# Altium schematic sheet FMC_CONNECTOR.schdoc: FMC Connector
size A3; DocumentNumber: 6; SheetNumber: 6; SheetTotal: 12
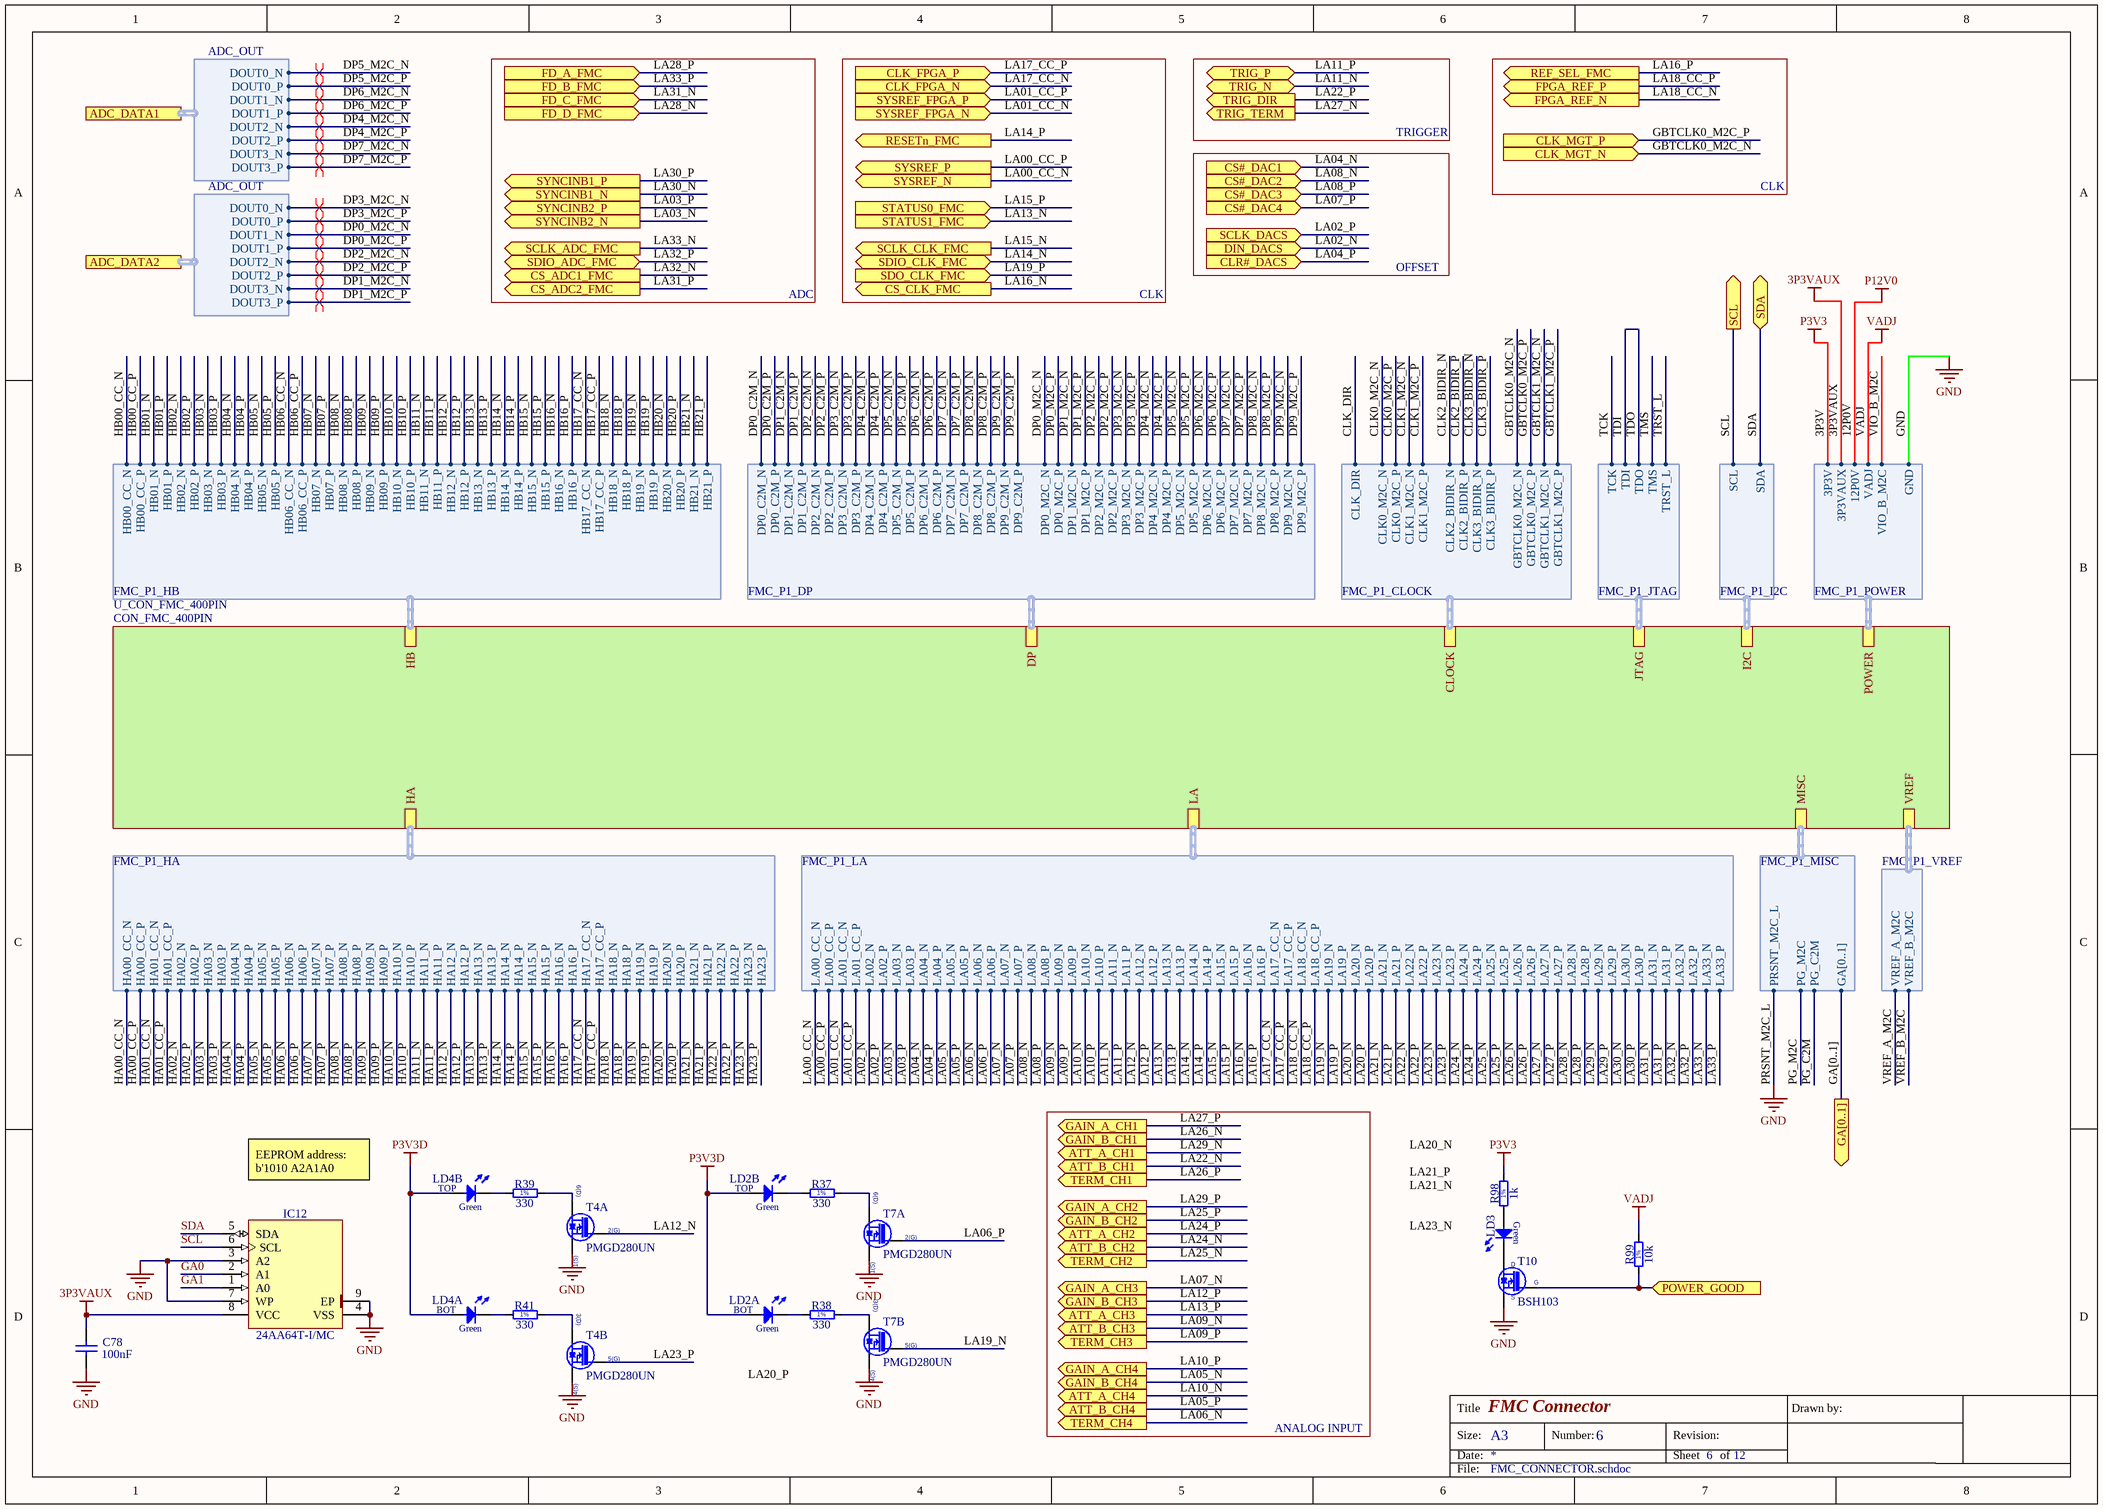
[diagram p0: FMC_CONNECTOR.schdoc]

## Parts
C78  100nF  [CAPC0603X33N]
IC12  24AA64T-I/MC  [SON50P300X200X100-9N-R175X155]
LD2  (no value)  [553-xxxx-300]  (parts A,B of 2)
LD3  (no value)  [LED0603X65N]
LD4  (no value)  [553-xxxx-300]  (parts A,B of 2)
R37  330  [RESC1005X40N]
R38  330  [RESC1005X40N]
R39  330  [RESC1005X40N]
R41  330  [RESC1005X40N]
R98  1k  [RESC1005X40N]
R99  10k  [RESC1608X55N]
T4  PMGD280UN  [SOT65P210X110-6N]  (parts A,B of 2)
T7  PMGD280UN  [SOT65P210X110-6N]  (parts A,B of 2)
T10  BSH103  [SOT95P230X110-3N]

## Sub-sheets
U_CON_FMC_400PIN = CON_FMC_400PIN: LA (harness FMC_P1_LA), HA (harness FMC_P1_HA), HB (harness FMC_P1_HB), MISC (harness FMC_P1_MISC), POWER (harness FMC_P1_POWER), JTAG (harness FMC_P1_JTAG), I2C (harness FMC_P1_I2C), CLOCK (harness FMC_P1_CLOCK), VREF (harness FMC_P1_VREF), DP (harness FMC_P1_DP)

## Ports
ADC_DATA1 (harness ADC_OUT), ADC_DATA2 (harness ADC_OUT), ATT_A_CH1 (out), ATT_A_CH2 (out), ATT_A_CH3 (out), ATT_A_CH4 (out), ATT_B_CH1 (out), ATT_B_CH2 (out), ATT_B_CH3 (out), ATT_B_CH4 (out), CLK_FPGA_N (in), CLK_FPGA_P (in), CLK_MGT_N (in), CLK_MGT_P (in), CLR#_DACS (in), CS#_DAC1 (in), CS#_DAC2 (in), CS#_DAC3 (in), CS#_DAC4 (in), CS_ADC1_FMC (out), CS_ADC2_FMC (out), CS_CLK_FMC (out), DIN_DACS (in), FD_A_FMC (in), FD_B_FMC (in), FD_C_FMC (in), FD_D_FMC (in), FPGA_REF_N (out), FPGA_REF_P (out), GA[0..1] (out), GAIN_A_CH1 (out), GAIN_A_CH2 (out), GAIN_A_CH3 (out), GAIN_A_CH4 (out), GAIN_B_CH1 (out), GAIN_B_CH2 (out), GAIN_B_CH3 (out), GAIN_B_CH4 (out), POWER_GOOD (in), REF_SEL_FMC (out), RESETn_FMC (out), SCL (out), SCLK_ADC_FMC (out), SCLK_CLK_FMC (out), SCLK_DACS (in), SDA (bidir), SDIO_ADC_FMC (bidir), SDIO_CLK_FMC (bidir), SDO_CLK_FMC (in), STATUS0_FMC (in), STATUS1_FMC (in), SYNCINB1_N (out), SYNCINB1_P (out), SYNCINB2_N (out), SYNCINB2_P (out), SYSREF_FPGA_N (in), SYSREF_FPGA_P (in), SYSREF_N (out), SYSREF_P (out), TERM_CH1 (out), TERM_CH2 (out), TERM_CH3 (out), TERM_CH4 (out), TRIG_DIR (out), TRIG_N (bidir), TRIG_P (bidir), TRIG_TERM (out)

## Harnesses
FMC_P1_DP: DP1_C2M_N, DP1_C2M_P, DP1_M2C_N, DP1_M2C_P, DP2_C2M_N, DP2_C2M_P, DP2_M2C_N, DP2_M2C_P, DP3_C2M_N, DP3_C2M_P, DP3_M2C_N, DP3_M2C_P, DP4_C2M_N, DP4_C2M_P, DP4_M2C_N, DP4_M2C_P, DP5_C2M_N, DP5_C2M_P, DP5_M2C_N, DP5_M2C_P, DP6_C2M_N, DP6_C2M_P, DP6_M2C_N, DP6_M2C_P, DP7_C2M_N, DP7_C2M_P, DP7_M2C_N, DP7_M2C_P, DP8_C2M_N, DP8_C2M_P, DP8_M2C_N, DP8_M2C_P, DP9_C2M_N, DP9_C2M_P, DP9_M2C_N, DP9_M2C_P, DP0_C2M_N, DP0_C2M_P, DP0_M2C_N, DP0_M2C_P
FMC_P1_MISC: PRSNT_M2C_L, PG_M2C, PG_C2M, GA[0..1]
FMC_P1_POWER: 3P3V, 3P3VAUX, 12P0V, VADJ, VIO_B_M2C, GND
FMC_P1_JTAG: TCK, TDI, TDO, TMS, TRST_L
FMC_P1_I2C: SCL, SDA
FMC_P1_CLOCK: CLK2_BIDIR_N, CLK2_BIDIR_P, CLK3_BIDIR_N, CLK3_BIDIR_P, CLK0_M2C_N, CLK0_M2C_P, CLK1_M2C_N, CLK1_M2C_P, CLK_DIR, GBTCLK0_M2C_N, GBTCLK0_M2C_P, GBTCLK1_M2C_N, GBTCLK1_M2C_P
FMC_P1_VREF: VREF_A_M2C, VREF_B_M2C
FMC_P1_HA: HA04_N, HA04_P, HA05_N, HA05_P, HA08_N, HA08_P, HA09_N, HA09_P, HA12_N, HA12_P, HA13_N, HA13_P, HA15_N, HA15_P, HA16_N, HA16_P, HA19_N, HA19_P, HA20_N, HA20_P, HA02_N, HA02_P, HA03_N, HA03_P, HA06_N, HA06_P, HA07_N, HA07_P, HA10_N, HA10_P, HA11_N, HA11_P, HA14_N, HA14_P, HA18_N, HA18_P, HA21_N, HA21_P, HA22_N, HA22_P, HA23_N, HA23_P, HA17_CC_N, HA17_CC_P, HA00_CC_N, HA00_CC_P, HA01_CC_N, HA01_CC_P
FMC_P1_LA: LA05_N, LA05_P, LA06_N, LA06_P, LA09_N, LA09_P, LA10_N, LA10_P, LA13_N, LA13_P, LA14_N, LA14_P, LA23_N, LA23_P, LA26_N, LA26_P, LA27_N, LA27_P, LA02_N, LA02_P, LA03_N, LA03_P, LA04_N, LA04_P, LA07_N, LA07_P, LA08_N, LA08_P, LA11_N, LA11_P, LA12_N, LA12_P, LA15_N, LA15_P, LA16_N, LA16_P, LA19_N, LA19_P, LA20_N, LA20_P, LA21_N, LA21_P, LA22_N, LA22_P, LA24_N, LA24_P, LA25_N, LA25_P, LA28_N, LA28_P, LA29_N, LA29_P, LA30_N, LA30_P, LA31_N, LA31_P, LA32_N, LA32_P, LA33_N, LA33_P, LA00_CC_N, LA00_CC_P, LA01_CC_N, LA01_CC_P, LA17_CC_N, LA17_CC_P, LA18_CC_N, LA18_CC_P
FMC_P1_HB: HB02_N, HB02_P, HB03_N, HB03_P, HB04_N, HB04_P, HB05_N, HB05_P, HB08_N, HB08_P, HB09_N, HB09_P, HB12_N, HB12_P, HB13_N, HB13_P, HB16_N, HB16_P, HB19_N, HB19_P, HB20_N, HB20_P, HB21_N, HB21_P, HB01_N, HB01_P, HB07_N, HB07_P, HB10_N, HB10_P, HB11_N, HB11_P, HB14_N, HB14_P, HB15_N, HB15_P, HB18_N, HB18_P, HB17_CC_N, HB17_CC_P, HB06_CC_N, HB06_CC_P, HB00_CC_N, HB00_CC_P
ADC_OUT: DOUT0_N, DOUT0_P, DOUT1_N, DOUT1_P, DOUT2_N, DOUT2_P, DOUT3_N, DOUT3_P

## Nets
3P3V: R98.2 ; sheet U_CON_FMC_400PIN/POWER.3P3V  [also labelled P3V3]
3P3VAUX: C78.2 IC12.8(VCC) ; sheet U_CON_FMC_400PIN/POWER.3P3VAUX
12P0V: sheet U_CON_FMC_400PIN/POWER.12P0V  [also labelled P12V0]
GND: C78.1 IC12.3(A2) IC12.4(VSS) IC12.7(WP) IC12.9(EP) T4.1(S) T4.4(S) T7.1(S) T7.4(S) T10.2(S) ; sheet U_CON_FMC_400PIN/MISC.PRSNT_M2C_L, sheet U_CON_FMC_400PIN/POWER.GND  [also labelled PRSNT_M2C_L]
P3V3D: LD2.2(A) LD2.4(A) LD4.2(A) LD4.4(A)
VADJ: R99.2 ; sheet U_CON_FMC_400PIN/POWER.VADJ
CLK0_M2C_N: sheet U_CON_FMC_400PIN/CLOCK.CLK0_M2C_N
CLK0_M2C_P: sheet U_CON_FMC_400PIN/CLOCK.CLK0_M2C_P
CLK1_M2C_N: sheet U_CON_FMC_400PIN/CLOCK.CLK1_M2C_N
CLK1_M2C_P: sheet U_CON_FMC_400PIN/CLOCK.CLK1_M2C_P
CLK2_BIDIR_N: sheet U_CON_FMC_400PIN/CLOCK.CLK2_BIDIR_N
CLK2_BIDIR_P: sheet U_CON_FMC_400PIN/CLOCK.CLK2_BIDIR_P
CLK3_BIDIR_N: sheet U_CON_FMC_400PIN/CLOCK.CLK3_BIDIR_N
CLK3_BIDIR_P: sheet U_CON_FMC_400PIN/CLOCK.CLK3_BIDIR_P
CLK_DIR: sheet U_CON_FMC_400PIN/CLOCK.CLK_DIR
DP0_C2M_N: sheet U_CON_FMC_400PIN/DP.DP0_C2M_N
DP0_C2M_P: sheet U_CON_FMC_400PIN/DP.DP0_C2M_P
DP0_M2C_N: sheet U_CON_FMC_400PIN/DP.DP0_M2C_N, port ADC_DATA2.DOUT1_N
DP0_M2C_P: sheet U_CON_FMC_400PIN/DP.DP0_M2C_P, port ADC_DATA2.DOUT1_P
DP1_C2M_N: sheet U_CON_FMC_400PIN/DP.DP1_C2M_N
DP1_C2M_P: sheet U_CON_FMC_400PIN/DP.DP1_C2M_P
DP1_M2C_N: sheet U_CON_FMC_400PIN/DP.DP1_M2C_N, port ADC_DATA2.DOUT3_N
DP1_M2C_P: sheet U_CON_FMC_400PIN/DP.DP1_M2C_P, port ADC_DATA2.DOUT3_P
DP2_C2M_N: sheet U_CON_FMC_400PIN/DP.DP2_C2M_N
DP2_C2M_P: sheet U_CON_FMC_400PIN/DP.DP2_C2M_P
DP2_M2C_N: sheet U_CON_FMC_400PIN/DP.DP2_M2C_N, port ADC_DATA2.DOUT2_N
DP2_M2C_P: sheet U_CON_FMC_400PIN/DP.DP2_M2C_P, port ADC_DATA2.DOUT2_P
DP3_C2M_N: sheet U_CON_FMC_400PIN/DP.DP3_C2M_N
DP3_C2M_P: sheet U_CON_FMC_400PIN/DP.DP3_C2M_P
DP3_M2C_N: sheet U_CON_FMC_400PIN/DP.DP3_M2C_N, port ADC_DATA2.DOUT0_N
DP3_M2C_P: sheet U_CON_FMC_400PIN/DP.DP3_M2C_P, port ADC_DATA2.DOUT0_P
DP4_C2M_N: sheet U_CON_FMC_400PIN/DP.DP4_C2M_N
DP4_C2M_P: sheet U_CON_FMC_400PIN/DP.DP4_C2M_P
DP4_M2C_N: sheet U_CON_FMC_400PIN/DP.DP4_M2C_N, port ADC_DATA1.DOUT2_N
DP4_M2C_P: sheet U_CON_FMC_400PIN/DP.DP4_M2C_P, port ADC_DATA1.DOUT2_P
DP5_C2M_N: sheet U_CON_FMC_400PIN/DP.DP5_C2M_N
DP5_C2M_P: sheet U_CON_FMC_400PIN/DP.DP5_C2M_P
DP5_M2C_N: sheet U_CON_FMC_400PIN/DP.DP5_M2C_N, port ADC_DATA1.DOUT0_N
DP5_M2C_P: sheet U_CON_FMC_400PIN/DP.DP5_M2C_P, port ADC_DATA1.DOUT0_P
DP6_C2M_N: sheet U_CON_FMC_400PIN/DP.DP6_C2M_N
DP6_C2M_P: sheet U_CON_FMC_400PIN/DP.DP6_C2M_P
DP6_M2C_N: sheet U_CON_FMC_400PIN/DP.DP6_M2C_N, port ADC_DATA1.DOUT1_N
DP6_M2C_P: sheet U_CON_FMC_400PIN/DP.DP6_M2C_P, port ADC_DATA1.DOUT1_P
DP7_C2M_N: sheet U_CON_FMC_400PIN/DP.DP7_C2M_N
DP7_C2M_P: sheet U_CON_FMC_400PIN/DP.DP7_C2M_P
DP7_M2C_N: sheet U_CON_FMC_400PIN/DP.DP7_M2C_N, port ADC_DATA1.DOUT3_N
DP7_M2C_P: sheet U_CON_FMC_400PIN/DP.DP7_M2C_P, port ADC_DATA1.DOUT3_P
DP8_C2M_N: sheet U_CON_FMC_400PIN/DP.DP8_C2M_N
DP8_C2M_P: sheet U_CON_FMC_400PIN/DP.DP8_C2M_P
DP8_M2C_N: sheet U_CON_FMC_400PIN/DP.DP8_M2C_N
DP8_M2C_P: sheet U_CON_FMC_400PIN/DP.DP8_M2C_P
DP9_C2M_N: sheet U_CON_FMC_400PIN/DP.DP9_C2M_N
DP9_C2M_P: sheet U_CON_FMC_400PIN/DP.DP9_C2M_P
DP9_M2C_N: sheet U_CON_FMC_400PIN/DP.DP9_M2C_N
DP9_M2C_P: sheet U_CON_FMC_400PIN/DP.DP9_M2C_P
GA0: IC12.2(A1)
GA1: IC12.1(A0)
GBTCLK0_M2C_N: port CLK_MGT_N, sheet U_CON_FMC_400PIN/CLOCK.GBTCLK0_M2C_N
GBTCLK0_M2C_P: port CLK_MGT_P, sheet U_CON_FMC_400PIN/CLOCK.GBTCLK0_M2C_P
GBTCLK1_M2C_N: sheet U_CON_FMC_400PIN/CLOCK.GBTCLK1_M2C_N
GBTCLK1_M2C_P: sheet U_CON_FMC_400PIN/CLOCK.GBTCLK1_M2C_P
HA00_CC_N: sheet U_CON_FMC_400PIN/HA.HA00_CC_N
HA00_CC_P: sheet U_CON_FMC_400PIN/HA.HA00_CC_P
HA01_CC_N: sheet U_CON_FMC_400PIN/HA.HA01_CC_N
HA01_CC_P: sheet U_CON_FMC_400PIN/HA.HA01_CC_P
HA02_N: sheet U_CON_FMC_400PIN/HA.HA02_N
HA02_P: sheet U_CON_FMC_400PIN/HA.HA02_P
HA03_N: sheet U_CON_FMC_400PIN/HA.HA03_N
HA03_P: sheet U_CON_FMC_400PIN/HA.HA03_P
HA04_N: sheet U_CON_FMC_400PIN/HA.HA04_N
HA04_P: sheet U_CON_FMC_400PIN/HA.HA04_P
HA05_N: sheet U_CON_FMC_400PIN/HA.HA05_N
HA05_P: sheet U_CON_FMC_400PIN/HA.HA05_P
HA06_N: sheet U_CON_FMC_400PIN/HA.HA06_N
HA06_P: sheet U_CON_FMC_400PIN/HA.HA06_P
HA07_N: sheet U_CON_FMC_400PIN/HA.HA07_N
HA07_P: sheet U_CON_FMC_400PIN/HA.HA07_P
HA08_N: sheet U_CON_FMC_400PIN/HA.HA08_N
HA08_P: sheet U_CON_FMC_400PIN/HA.HA08_P
HA09_N: sheet U_CON_FMC_400PIN/HA.HA09_N
HA09_P: sheet U_CON_FMC_400PIN/HA.HA09_P
HA10_N: sheet U_CON_FMC_400PIN/HA.HA10_N
HA10_P: sheet U_CON_FMC_400PIN/HA.HA10_P
HA11_N: sheet U_CON_FMC_400PIN/HA.HA11_N
HA11_P: sheet U_CON_FMC_400PIN/HA.HA11_P
HA12_N: sheet U_CON_FMC_400PIN/HA.HA12_N
HA12_P: sheet U_CON_FMC_400PIN/HA.HA12_P
HA13_N: sheet U_CON_FMC_400PIN/HA.HA13_N
HA13_P: sheet U_CON_FMC_400PIN/HA.HA13_P
HA14_N: sheet U_CON_FMC_400PIN/HA.HA14_N
HA14_P: sheet U_CON_FMC_400PIN/HA.HA14_P
HA15_N: sheet U_CON_FMC_400PIN/HA.HA15_N
HA15_P: sheet U_CON_FMC_400PIN/HA.HA15_P
HA16_N: sheet U_CON_FMC_400PIN/HA.HA16_N
HA16_P: sheet U_CON_FMC_400PIN/HA.HA16_P
HA17_CC_N: sheet U_CON_FMC_400PIN/HA.HA17_CC_N
HA17_CC_P: sheet U_CON_FMC_400PIN/HA.HA17_CC_P
HA18_N: sheet U_CON_FMC_400PIN/HA.HA18_N
HA18_P: sheet U_CON_FMC_400PIN/HA.HA18_P
HA19_N: sheet U_CON_FMC_400PIN/HA.HA19_N
HA19_P: sheet U_CON_FMC_400PIN/HA.HA19_P
HA20_N: sheet U_CON_FMC_400PIN/HA.HA20_N
HA20_P: sheet U_CON_FMC_400PIN/HA.HA20_P
HA21_N: sheet U_CON_FMC_400PIN/HA.HA21_N
HA21_P: sheet U_CON_FMC_400PIN/HA.HA21_P
HA22_N: sheet U_CON_FMC_400PIN/HA.HA22_N
HA22_P: sheet U_CON_FMC_400PIN/HA.HA22_P
HA23_N: sheet U_CON_FMC_400PIN/HA.HA23_N
HA23_P: sheet U_CON_FMC_400PIN/HA.HA23_P
HB00_CC_N: sheet U_CON_FMC_400PIN/HB.HB00_CC_N
HB00_CC_P: sheet U_CON_FMC_400PIN/HB.HB00_CC_P
HB01_N: sheet U_CON_FMC_400PIN/HB.HB01_N
HB01_P: sheet U_CON_FMC_400PIN/HB.HB01_P
HB02_N: sheet U_CON_FMC_400PIN/HB.HB02_N
HB02_P: sheet U_CON_FMC_400PIN/HB.HB02_P
HB03_N: sheet U_CON_FMC_400PIN/HB.HB03_N
HB03_P: sheet U_CON_FMC_400PIN/HB.HB03_P
HB04_N: sheet U_CON_FMC_400PIN/HB.HB04_N
HB04_P: sheet U_CON_FMC_400PIN/HB.HB04_P
HB05_N: sheet U_CON_FMC_400PIN/HB.HB05_N
HB05_P: sheet U_CON_FMC_400PIN/HB.HB05_P
HB06_CC_N: sheet U_CON_FMC_400PIN/HB.HB06_CC_N
HB06_CC_P: sheet U_CON_FMC_400PIN/HB.HB06_CC_P
HB07_N: sheet U_CON_FMC_400PIN/HB.HB07_N
HB07_P: sheet U_CON_FMC_400PIN/HB.HB07_P
HB08_N: sheet U_CON_FMC_400PIN/HB.HB08_N
HB08_P: sheet U_CON_FMC_400PIN/HB.HB08_P
HB09_N: sheet U_CON_FMC_400PIN/HB.HB09_N
HB09_P: sheet U_CON_FMC_400PIN/HB.HB09_P
HB10_N: sheet U_CON_FMC_400PIN/HB.HB10_N
HB10_P: sheet U_CON_FMC_400PIN/HB.HB10_P
HB11_N: sheet U_CON_FMC_400PIN/HB.HB11_N
HB11_P: sheet U_CON_FMC_400PIN/HB.HB11_P
HB12_N: sheet U_CON_FMC_400PIN/HB.HB12_N
HB12_P: sheet U_CON_FMC_400PIN/HB.HB12_P
HB13_N: sheet U_CON_FMC_400PIN/HB.HB13_N
HB13_P: sheet U_CON_FMC_400PIN/HB.HB13_P
HB14_N: sheet U_CON_FMC_400PIN/HB.HB14_N
HB14_P: sheet U_CON_FMC_400PIN/HB.HB14_P
HB15_N: sheet U_CON_FMC_400PIN/HB.HB15_N
HB15_P: sheet U_CON_FMC_400PIN/HB.HB15_P
HB16_N: sheet U_CON_FMC_400PIN/HB.HB16_N
HB16_P: sheet U_CON_FMC_400PIN/HB.HB16_P
HB17_CC_N: sheet U_CON_FMC_400PIN/HB.HB17_CC_N
HB17_CC_P: sheet U_CON_FMC_400PIN/HB.HB17_CC_P
HB18_N: sheet U_CON_FMC_400PIN/HB.HB18_N
HB18_P: sheet U_CON_FMC_400PIN/HB.HB18_P
HB19_N: sheet U_CON_FMC_400PIN/HB.HB19_N
HB19_P: sheet U_CON_FMC_400PIN/HB.HB19_P
HB20_N: sheet U_CON_FMC_400PIN/HB.HB20_N
HB20_P: sheet U_CON_FMC_400PIN/HB.HB20_P
HB21_N: sheet U_CON_FMC_400PIN/HB.HB21_N
HB21_P: sheet U_CON_FMC_400PIN/HB.HB21_P
LA00_CC_N: port SYSREF_N, sheet U_CON_FMC_400PIN/LA.LA00_CC_N
LA00_CC_P: port SYSREF_P, sheet U_CON_FMC_400PIN/LA.LA00_CC_P
LA01_CC_N: port SYSREF_FPGA_N, sheet U_CON_FMC_400PIN/LA.LA01_CC_N
LA01_CC_P: port SYSREF_FPGA_P, sheet U_CON_FMC_400PIN/LA.LA01_CC_P
LA02_N: port DIN_DACS, sheet U_CON_FMC_400PIN/LA.LA02_N
LA02_P: port SCLK_DACS, sheet U_CON_FMC_400PIN/LA.LA02_P
LA03_N: port SYNCINB2_N, sheet U_CON_FMC_400PIN/LA.LA03_N
LA03_P: port SYNCINB2_P, sheet U_CON_FMC_400PIN/LA.LA03_P
LA04_N: port CS#_DAC1, sheet U_CON_FMC_400PIN/LA.LA04_N
LA04_P: port CLR#_DACS, sheet U_CON_FMC_400PIN/LA.LA04_P
LA05_N: port GAIN_B_CH4, sheet U_CON_FMC_400PIN/LA.LA05_N
LA05_P: port ATT_B_CH4, sheet U_CON_FMC_400PIN/LA.LA05_P
LA06_N: port TERM_CH4, sheet U_CON_FMC_400PIN/LA.LA06_N
LA06_P: T7.2(G) ; sheet U_CON_FMC_400PIN/LA.LA06_P
LA07_N: port GAIN_A_CH3, sheet U_CON_FMC_400PIN/LA.LA07_N
LA07_P: port CS#_DAC4, sheet U_CON_FMC_400PIN/LA.LA07_P
LA08_N: port CS#_DAC2, sheet U_CON_FMC_400PIN/LA.LA08_N
LA08_P: port CS#_DAC3, sheet U_CON_FMC_400PIN/LA.LA08_P
LA09_N: port ATT_B_CH3, sheet U_CON_FMC_400PIN/LA.LA09_N
LA09_P: port TERM_CH3, sheet U_CON_FMC_400PIN/LA.LA09_P
LA10_N: port ATT_A_CH4, sheet U_CON_FMC_400PIN/LA.LA10_N
LA10_P: port GAIN_A_CH4, sheet U_CON_FMC_400PIN/LA.LA10_P
LA11_N: port TRIG_N, sheet U_CON_FMC_400PIN/LA.LA11_N
LA11_P: port TRIG_P, sheet U_CON_FMC_400PIN/LA.LA11_P
LA12_N: T4.2(G) ; sheet U_CON_FMC_400PIN/LA.LA12_N
LA12_P: port GAIN_B_CH3, sheet U_CON_FMC_400PIN/LA.LA12_P
LA13_N: port STATUS1_FMC, sheet U_CON_FMC_400PIN/LA.LA13_N
LA13_P: port ATT_A_CH3, sheet U_CON_FMC_400PIN/LA.LA13_P
LA14_N: port SDIO_CLK_FMC, sheet U_CON_FMC_400PIN/LA.LA14_N
LA14_P: port RESETn_FMC, sheet U_CON_FMC_400PIN/LA.LA14_P
LA15_N: port SCLK_CLK_FMC, sheet U_CON_FMC_400PIN/LA.LA15_N
LA15_P: port STATUS0_FMC, sheet U_CON_FMC_400PIN/LA.LA15_P
LA16_N: port CS_CLK_FMC, sheet U_CON_FMC_400PIN/LA.LA16_N
LA16_P: port REF_SEL_FMC, sheet U_CON_FMC_400PIN/LA.LA16_P
LA17_CC_N: port CLK_FPGA_N, sheet U_CON_FMC_400PIN/LA.LA17_CC_N
LA17_CC_P: port CLK_FPGA_P, sheet U_CON_FMC_400PIN/LA.LA17_CC_P
LA18_CC_N: port FPGA_REF_N, sheet U_CON_FMC_400PIN/LA.LA18_CC_N
LA18_CC_P: port FPGA_REF_P, sheet U_CON_FMC_400PIN/LA.LA18_CC_P
LA19_N: T7.5(G) ; sheet U_CON_FMC_400PIN/LA.LA19_N
LA19_P: port SDO_CLK_FMC, sheet U_CON_FMC_400PIN/LA.LA19_P
LA20_N: sheet U_CON_FMC_400PIN/LA.LA20_N
LA20_P: sheet U_CON_FMC_400PIN/LA.LA20_P
LA21_N: sheet U_CON_FMC_400PIN/LA.LA21_N
LA21_P: sheet U_CON_FMC_400PIN/LA.LA21_P
LA22_N: port ATT_B_CH1, sheet U_CON_FMC_400PIN/LA.LA22_N
LA22_P: port TRIG_DIR, sheet U_CON_FMC_400PIN/LA.LA22_P
LA23_N: sheet U_CON_FMC_400PIN/LA.LA23_N
LA23_P: T4.5(G) ; sheet U_CON_FMC_400PIN/LA.LA23_P
LA24_N: port ATT_B_CH2, sheet U_CON_FMC_400PIN/LA.LA24_N
LA24_P: port ATT_A_CH2, sheet U_CON_FMC_400PIN/LA.LA24_P
LA25_N: port TERM_CH2, sheet U_CON_FMC_400PIN/LA.LA25_N
LA25_P: port GAIN_B_CH2, sheet U_CON_FMC_400PIN/LA.LA25_P
LA26_N: port GAIN_B_CH1, sheet U_CON_FMC_400PIN/LA.LA26_N
LA26_P: port TERM_CH1, sheet U_CON_FMC_400PIN/LA.LA26_P
LA27_N: port TRIG_TERM, sheet U_CON_FMC_400PIN/LA.LA27_N
LA27_P: port GAIN_A_CH1, sheet U_CON_FMC_400PIN/LA.LA27_P
LA28_N: port FD_D_FMC, sheet U_CON_FMC_400PIN/LA.LA28_N
LA28_P: port FD_A_FMC, sheet U_CON_FMC_400PIN/LA.LA28_P
LA29_N: port ATT_A_CH1, sheet U_CON_FMC_400PIN/LA.LA29_N
LA29_P: port GAIN_A_CH2, sheet U_CON_FMC_400PIN/LA.LA29_P
LA30_N: port SYNCINB1_N, sheet U_CON_FMC_400PIN/LA.LA30_N
LA30_P: port SYNCINB1_P, sheet U_CON_FMC_400PIN/LA.LA30_P
LA31_N: port FD_C_FMC, sheet U_CON_FMC_400PIN/LA.LA31_N
LA31_P: port CS_ADC2_FMC, sheet U_CON_FMC_400PIN/LA.LA31_P
LA32_N: port CS_ADC1_FMC, sheet U_CON_FMC_400PIN/LA.LA32_N
LA32_P: port SDIO_ADC_FMC, sheet U_CON_FMC_400PIN/LA.LA32_P
LA33_N: port SCLK_ADC_FMC, sheet U_CON_FMC_400PIN/LA.LA33_N
LA33_P: port FD_B_FMC, sheet U_CON_FMC_400PIN/LA.LA33_P
PG_C2M: sheet U_CON_FMC_400PIN/MISC.PG_C2M
PG_M2C: sheet U_CON_FMC_400PIN/MISC.PG_M2C
POWER_GOOD: R99.1 T10.1(G) ; port POWER_GOOD
SCL: IC12.6(SCL) ; port SCL, sheet U_CON_FMC_400PIN/I2C.SCL
SDA: IC12.5(SDA) ; port SDA, sheet U_CON_FMC_400PIN/I2C.SDA
TCK: sheet U_CON_FMC_400PIN/JTAG.TCK
TDI: sheet U_CON_FMC_400PIN/JTAG.TDI, sheet U_CON_FMC_400PIN/JTAG.TDO  [also labelled TDO]
TMS: sheet U_CON_FMC_400PIN/JTAG.TMS
TRST_L: sheet U_CON_FMC_400PIN/JTAG.TRST_L
VIO_B_M2C: sheet U_CON_FMC_400PIN/POWER.VIO_B_M2C
VREF_A_M2C: sheet U_CON_FMC_400PIN/VREF.VREF_A_M2C
VREF_B_M2C: sheet U_CON_FMC_400PIN/VREF.VREF_B_M2C
NetLD2_1: LD2.1(C) R38.1
NetLD2_3: LD2.3(C) R37.1
NetLD3_1: LD3.1(A) R98.1
NetLD3_2: LD3.2(C) T10.3(D)
NetLD4_1: LD4.1(C) R41.1
NetLD4_3: LD4.3(C) R39.1
NetR37_2: R37.2 T7.6(D)
NetR38_2: R38.2 T7.3(D)
NetR39_2: R39.2 T4.6(D)
NetR41_2: R41.2 T4.3(D)

## Buses and harness runs
bus GA[0..1] = port GA[0..1]

## Layout directives
differential pair: DP0_M2C_N, DP0_M2C_P, DP1_M2C_N, DP1_M2C_P, DP2_M2C_N, DP2_M2C_P, DP3_M2C_N, DP3_M2C_P, DP4_M2C_N, DP4_M2C_P, DP5_M2C_N, DP5_M2C_P, DP6_M2C_N, DP6_M2C_P, DP7_M2C_N, DP7_M2C_P

## Notes on the sheet
- TRIGGER
- CLK
- ADC
- OFFSET
- EEPROM address: b'1010 A2A1A0
- ANALOG INPUT
- Labels drawn without touching a wire or pin: LA20_N, LA20_P, LA21_N, LA21_P, LA23_N
- Title
- Size:
- Date:
- A3
- Number:
- Revision:
- Sheet
- of
- Drawn by:
- File:
- (in symbol KPH-1608CGCK) Green
- (in symbol LED x2 Green 553-0122-300, part A) BOT; Green
- (in symbol LED x2 Green 553-0122-300, part B) TOP; Green
- (in symbol PMGD280UN, part A) 6(D); 2(G); 1(S)
- (in symbol PMGD280UN, part B) 3(D); 5(G); 4(S)
- (in symbol R0402_1k_1%_0.0625W_100PPM) 1%
- (in symbol R0402_330R_1%_0.0625W_100PPM) 1%
- (in symbol R0603_10K_1%_0.1W_100PPM) 1%

## Library data of the parts
C78 = CC0201_100NF_6.3V_10%_X5R: Non-polarised capacitor; Part Description: SMD Multilayer Chip Ceramic Capacitor; Manufacturer: GENERIC; Manufacturer1 Part Number: 02016D104KAT2A; Tolerance: ±10%; Voltage: 6.3V; TC: X5R; Value: 100nF; Part Number: CC0201_100NF_6.3V_10%_X5R; Component Kind: Standard; Component Type: Standard; Pin Count: 2; Status: Not Recommended; Manufacturer Part Number: CC0201_100NF_6.3V_10%_X5R; Case: 0201; Mounted: Yes; Socket: No; SMD: Yes; Sense: No; Manufacturer1 Example: AVX; Manufacturer1 ComponentHeight: 0.33mm; HelpURL: \\cern.ch\dfs\Applications\Altium\Datasheets\CC0201_X5R_AVX.pdf; Author: CERN DEM JLC; CreateDate: 03.12.2007; LatestRevisionDate: 03.12.2007
IC12 = 24AA64T-I/MC: 1.7V-5.5V 64K I2C Serial EEPROM; Part Description: 1.7V-5.5V, 64K  (8K x 8-bit) I2C Serial EEPROM; Manufacturer: MICROCHIP TECHNOLOGY; PressFit: No; Bonding: No; Part Number: 24AA64T-I/MC; Component Kind: Standard; Component Type: Standard; Device: 24AA64T-I/MC; PackageDescription: SON (DFN), 0.50mm pitch, 8 pin, 2mm X 3mm X 1.00mm H body (w/thermal tab 1.75 X 1.55mm),  IPC Medium Density; Manufacturer Part Number: 24AA64T-I/MC; Pin Count: 9; Case: DFN8; Mounted: Yes; Socket: No; SMD: Yes; Sense: No; ComponentHeight: 1mm; HelpURL: \\cern.ch\dfs\Applications\Altium\Datasheets\24AA64T-I-MC.pdf; Author: CERN DEM JLC; CreateDate: 18.11.2009; LatestRevisionDate: 24.01.2011
LD2 LD4 = LED x2 Green 553-0122-300: Manufacturer: Dialight; Manufacturer Part Number: 553-0122-300; ComponentHeight: 9.65mm
LD3 = KPH-1608CGCK: LED Green, SMD 0603; Manufacturer: Kingbright; Manufacturer Part Number: KPH-1608CGCK; ComponentHeight: 0.65mm; HelpURL: http://www.kingbright.com/attachments/file/psearch/000/00/00/KPH-1608CGCK(Ver.20B).pdf; Package Description: SMT Green LED, Case 0603, Body L 1.6 x W 0.8mm H 0.65mm
R37-R39 R41 = R0402_330R_1%_0.0625W_100PPM: Resistor - 1%; Part Description: General Purpose Thick Film Chip Resistor; Manufacturer: GENERIC; Manufacturer1 Part Number: 232270673301L; TC: ±100ppm/°C; Part Number: R0402_330R_1%_0.0625W_100PPM; Component Kind: Standard; Component Type: Standard; Pin Count: 2; Value: 330; Status: Not recommended; Power: 0.0625W; Tolerance: ±1%; Manufacturer Part Number: R0402_330R_1%_0.0625W_100PPM; Case: 0402; Mounted: Yes; Sense: No; Socket: No; SMD: Yes; Manufacturer1 Example: YAGEO PHYCOMP; Manufacturer1 ComponentHeight: 0.4mm; HelpURL: \\cern.ch\dfs\Applications\Altium\Datasheets\R0402_Phycomp_RC0402.pdf; Author: CERN DEM JLC; CreateDate: 03.12.2007; LatestRevisionDate: 17.10.2012
R98 = R0402_1k_1%_0.0625W_100PPM: Resistor - 1%; Part Description: General Purpose Thick Film Chip Resistor; Manufacturer: GENERIC; Manufacturer1 Part Number: 232270671002L; TC: ±100ppm/°C; PressFit: No; Part Number: R0402_1K_1%_0.0625W_100PPM; Component Kind: Standard; Component Type: Standard; Pin Count: 2; Value: 1k; Status: Not Recommended; Power: 0.0625W; Tolerance: ±1%; Manufacturer Part Number: R0402_1K_1%_0.0625W_100PPM; Case: 0402; Mounted: Yes; Sense: No; Socket: No; SMD: Yes; Manufacturer1 Example: YAGEO PHYCOMP; Manufacturer1 ComponentHeight: 0.4mm; HelpURL: \\cern.ch\dfs\Applications\Altium\Datasheets\R0402_Phycomp_RC0402.pdf; Author: CERN DEM JLC; CreateDate: 03.12.2007; LatestRevisionDate: 17.10.2012
R99 = R0603_10K_1%_0.1W_100PPM: Resistor - 1%; Part Description: General Purpose Thick Film Chip Resistor; Manufacturer: GENERIC; Manufacturer1 Part Number: NRC06F1002TRF; Power: 0.1W; TC: ±100ppm/°C; Part Number: R0603_10K_1%_0.1W_100PPM; Component Kind: Standard; Component Type: Standard; Pin Count: 2; Value: 10k; Status: Preferred; Tolerance: ±1%; Manufacturer Part Number: R0603_10K_1%_0.1W_100PPM; Case: 0603; Mounted: Yes; Sense: No; Socket: No; SMD: Yes; Manufacturer1 Example: NIC COMPONENT; Manufacturer1 ComponentHeight: 0.55mm; HelpURL: \\cern.ch\dfs\Applications\Altium\Datasheets\R0603_NIC_NRC.pdf; Author: CERN DEM JLC; CreateDate: 03.12.2007; LatestRevisionDate: 13.03.2008
T4 T7 = PMGD280UN: Dual N-Channel micro TrenchMOS™ Ultra Low Level FET; Part Description: 20V 870mA Dual N-Channel micro TrenchMOS™ Ultra Low Level FET; Manufacturer: NXP SEMICONDUCTORS; PressFit: No; Bonding: No; Part Number: PMGD280UN; Component Kind: Standard; Component Type: Standard; Device: PMGD280UN; PackageDescription: SOT363, SC70-6, SOT, 0.65mm Pitch, 6 pin, 1.25mm W X 2.00mm L X 1.10mm H, IPC Medium Density; Manufacturer Part Number: PMGD280UN; Pin Count: 6; Case: SOT363; Mounted: Yes; Socket: No; SMD: Yes; Sense: No; ComponentHeight: 1.1mm; HelpURL: \\cern.ch\dfs\Applications\Altium\Datasheets\PMGD280UN.pdf; Author: CERN DEM JLC; CreateDate: 19.11.2014; LatestRevisionDate: 19.11.2014
T10 = BSH103: N-CHANNEL MOSFET WITH DIODE; Part Description: 30V 850mA N-Channel Enhancement Mode Field-Effect Transistor; Manufacturer: NEXPERIA; PressFit: No; Bonding: No; Part Number: BSH103; Component Kind: Standard; Component Type: Standard; Device: BSH103; PackageDescription: SOT23, 3 pin, Pitch 0.95mm - 1.3mm W X 2.9mm L X 1.1mm H, IPC Medium Density; Manufacturer Part Number: BSH103; Pin Count: 3; Case: SOT23-3; Mounted: Yes; Socket: No; SMD: Yes; Sense: No; ComponentHeight: 1.1mm; HelpURL: \\cern.ch\dfs\Applications\Altium\Datasheets\BSH103.pdf; Author: CERN DEM JLC; CreateDate: 16.03.2010; LatestRevisionDate: 20.06.2017